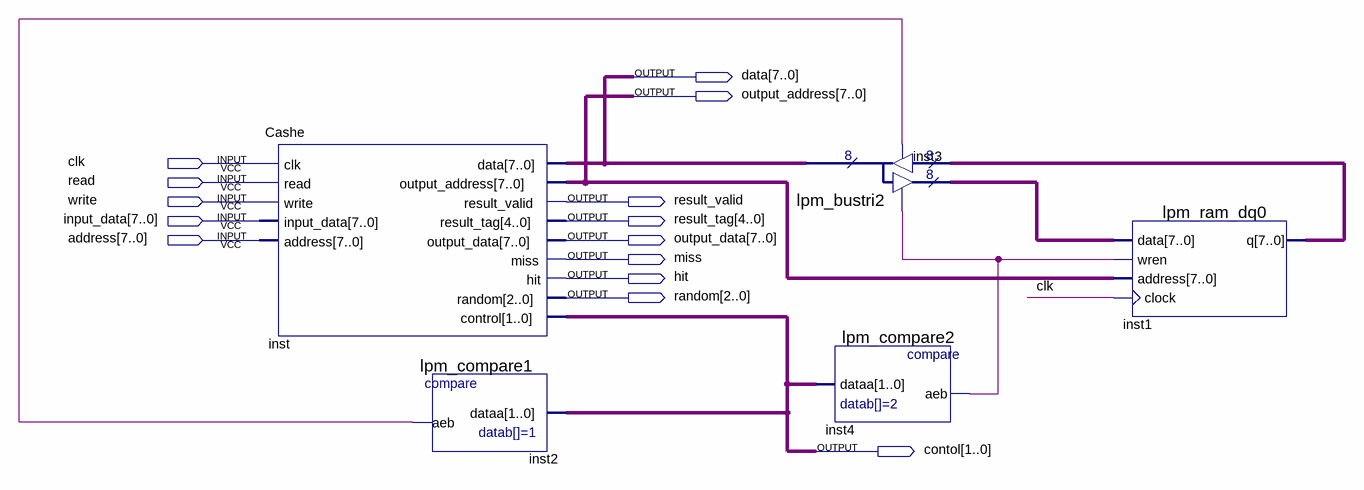
[diagram p0: schematic sheet]
// Quartus schematic MainBlock.bdf as structural Verilog: 5 symbols, 14 pins
module MainBlock (
  input  clk,
  input  read,
  input  write,
  input  [7:0] input_data,
  input  [7:0] address,
  output [7:0] data,
  output [7:0] output_address,
  output result_valid,
  output [4:0] result_tag,
  output [7:0] output_data,
  output miss,
  output hit,
  output [2:0] random,
  output [1:0] contol
);

  wire inst2_aeb, inst4_aeb;
  wire [7:0] inst1_q, inst3_result;

  Cashe inst (
    .clk(clk), .read(read), .write(write), .input_data(input_data), .address(address),
    .output_address(output_address), .result_valid(result_valid), .result_tag(result_tag),
    .output_data(output_data), .miss(miss), .hit(hit), .random(random), .control(contol), .data(data));
  lpm_compare1 inst2 (.dataa(contol), .aeb(inst2_aeb));
  lpm_bustri2 inst3 (.enabledt(inst2_aeb), .data(inst1_q), .enabletr(inst4_aeb), .result(inst3_result), .tridata(data));
  lpm_compare2 inst4 (.dataa(contol), .aeb(inst4_aeb));
  lpm_ram_dq0 inst1 (.data(inst3_result), .wren(inst4_aeb), .address(output_address), .clock(clk), .q(inst1_q));
endmodule
